# EasyEDA Pro project ProPrj_stm32线束检测系统_2025-05-19.epro, board stm32h743
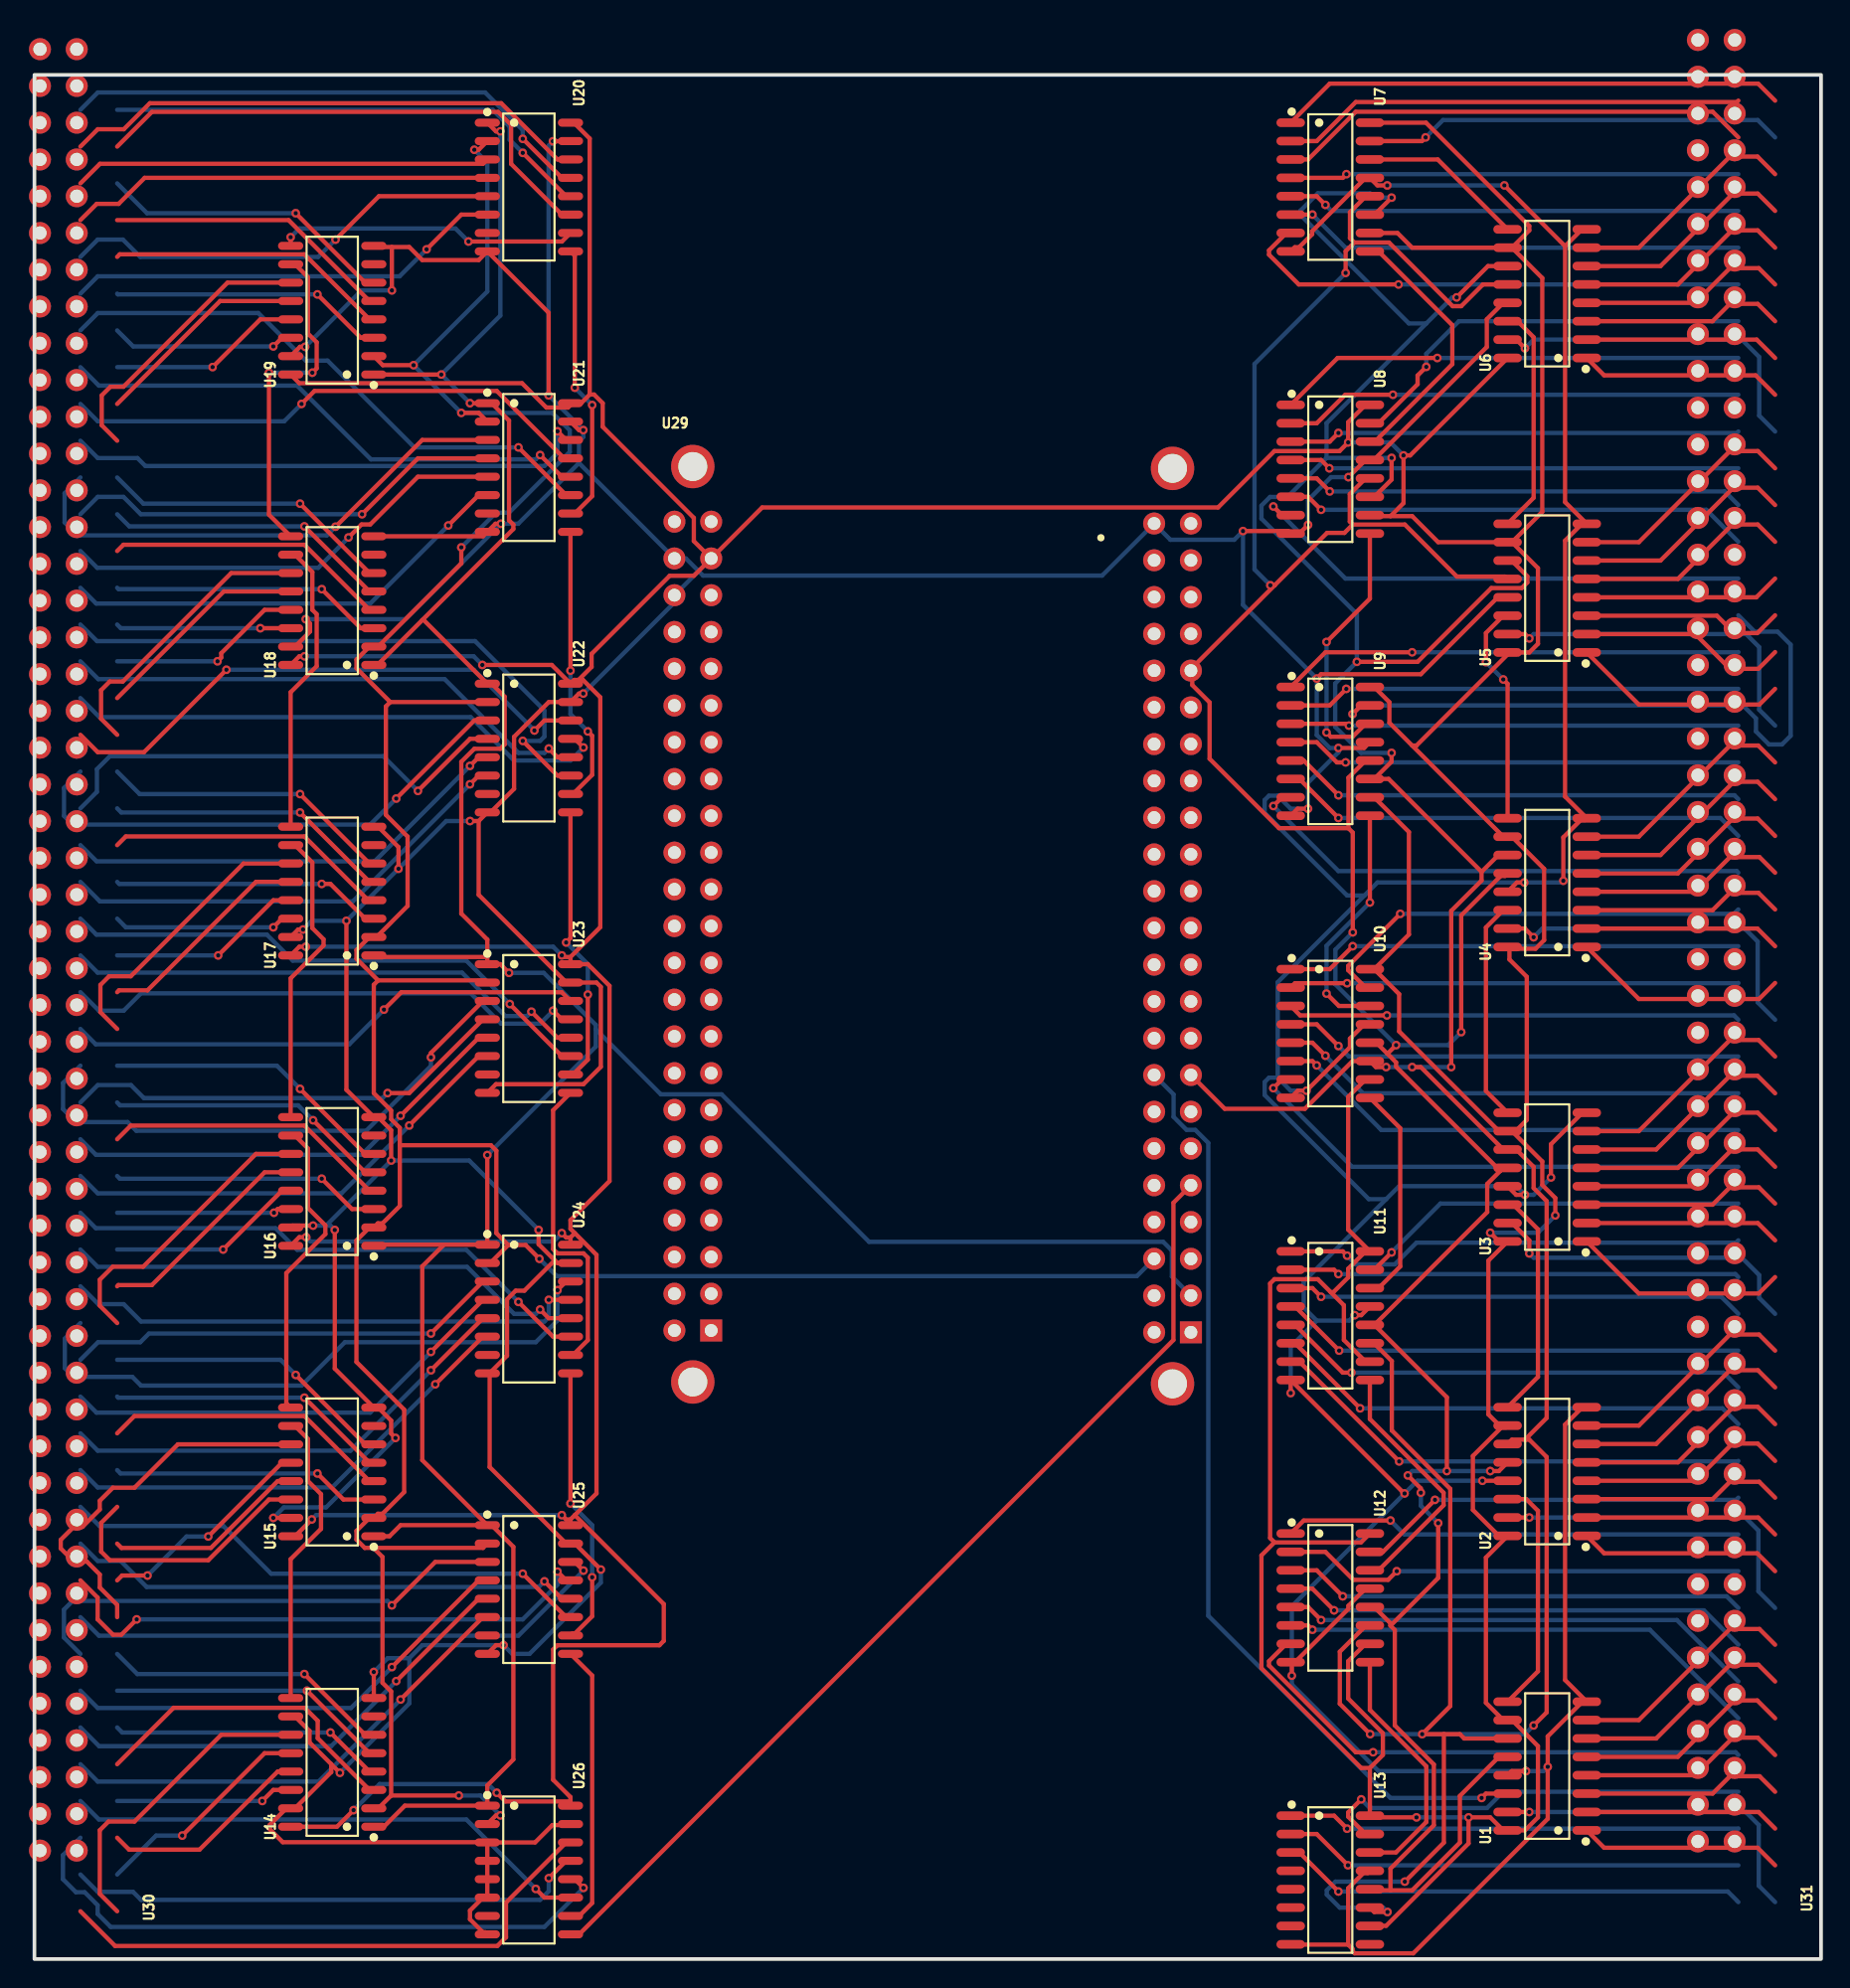
[diagram p1: board, top side]
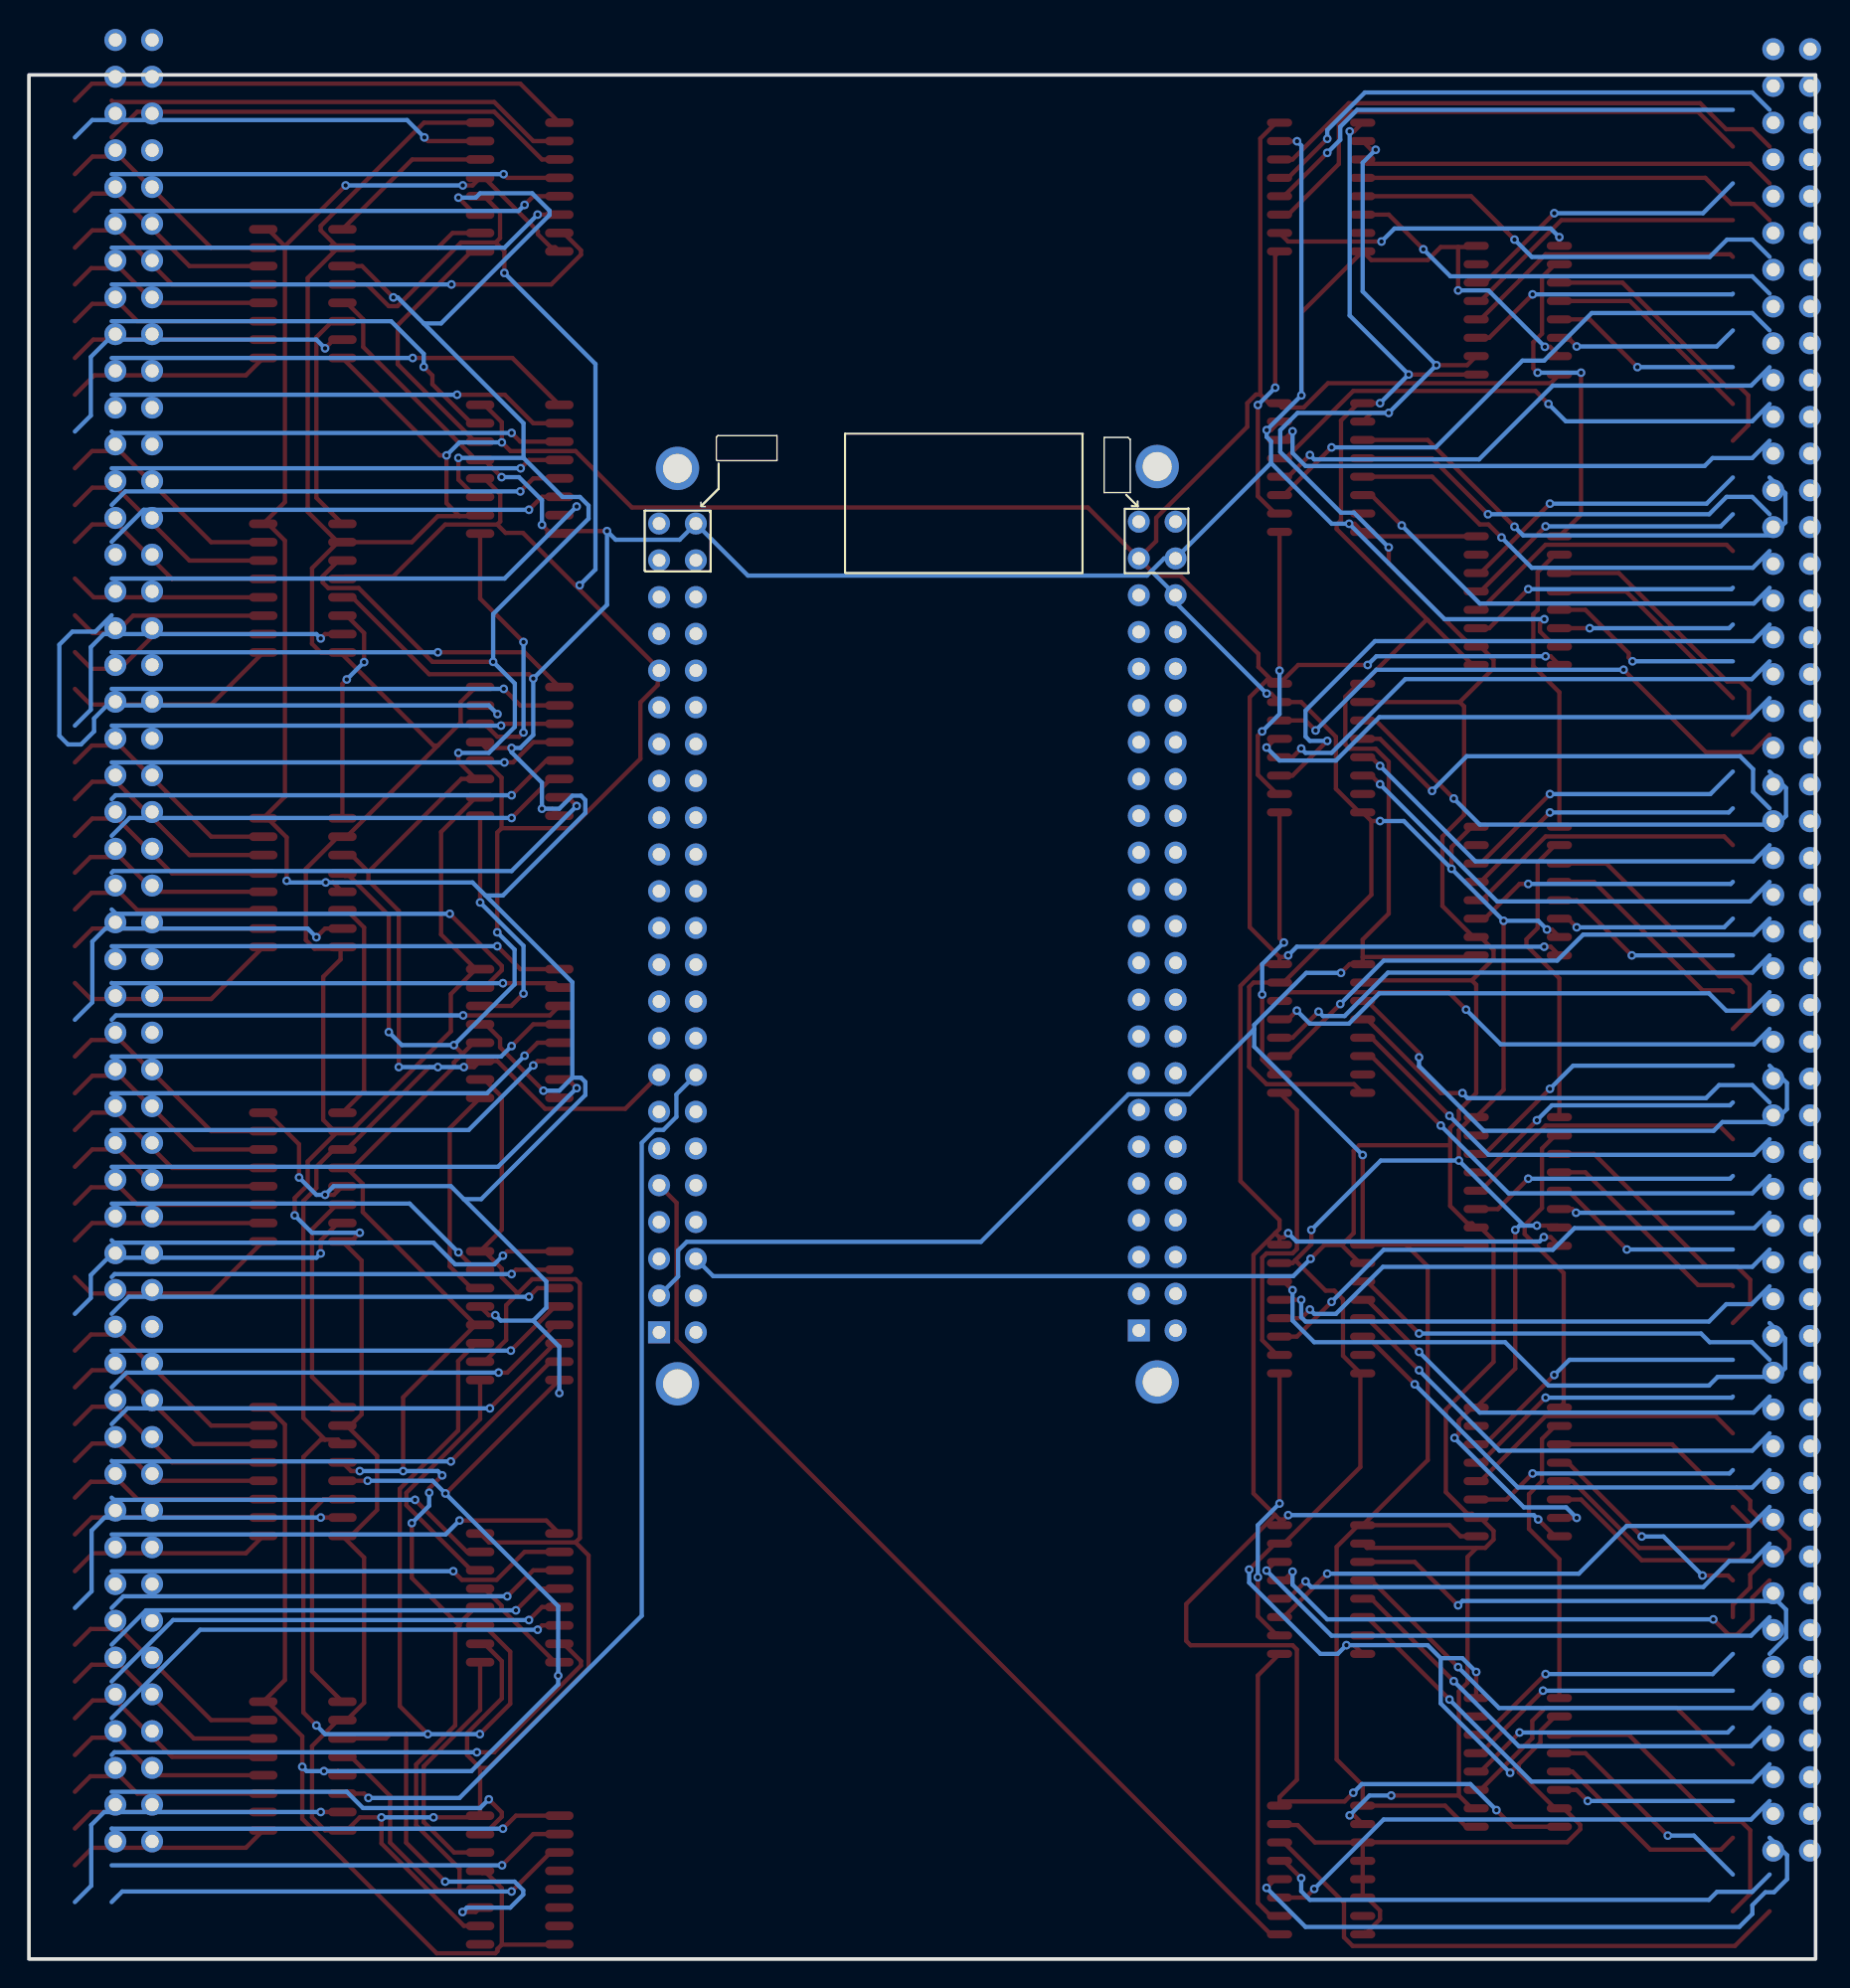
[diagram p2: board, bottom side, seen from below]

Outline 123.44 x 130.18 mm; copper layers: Top Layer, Signal Layer 1, Signal Layer 2, Bottom Layer. Coordinates in mm from the lower left corner of the outline.
Outline path: rectangle 0,130.18 123.44,0
Stack: Top Layer 0.0356mm / Signal Layer 1 0.036mm / Signal Layer 2 0.036mm / Bottom Layer 0.0356mm

## Design rules (mm)
net C4: 176v2
net C10: 176v2
net C14: 176v2
net C15: 176v2
net C24: 176v2
net C25: 176v2
net C26: 176v2
net C27: 176v2
net C28: 176v2
net C30: 176v2
net CON1: 176v2
net J3: 176v2
net R13: 176v2
net R14: 176v2
net R15: 176v2
net R51: 176v2
net R116: 176v2
net R117: 176v2
net R1013: 176v2
net U3: 176v2
net XY1: 176v2
net BAT: 176v2
net C3A: 176v2
net C3: 176v2
net C7: 176v2
net C8: 176v2
net C9: 176v2
net C29: 176v2
net dd3: 176v2
net R4: 176v2
net R7: 176v2
net R8: 176v2
net R9: 176v2
net R11: 176v2
net R12: 176v2
net SD1: 176v2
net U2: 176v2
net SW3: 176v2
net LED: 176v2
net QPSI: 176v2
net R8A: 176v2
net SPI: 176v2
net C27A: 176v2
net C28A: 176v2
net Y1: 176v2
net RP1: 176v2
net LED3: 176v2
net C29A: 176v2
net TYPE: 176v2
net U1: 176v2
net SWD: 176v2
net C21A: 176v2
net CAM: 176v2
net D1: 176v2
net FPC: 176v2
net ISP: 176v2
net Q1: 176v2
net Q2: 176v2
net R7A: 176v2
net R8AA: 176v2
net R19: 176v2
net JA: 176v2
net JB: 176v2
net J5: 176v2
template: 用户自定义配置
spacing Clearance_1 (default): track to track 0.15, other pairs 0.15 to 0.15
track width Width (default): min 0.3, default 0.3, max 1.001
differential pair DiffPairsRouting (default): width min 0.381, default 0.381, max 0.381; gap min 0.254, default 0.254
via RoutingVias (default): diameter min 0, default 0.599, max 1.27; hole min 0, default 0.3, max 0.711

## Placement (name value [footprint] x y rotation side)
U1  74HC595D,118  [SOIC-16_L9.9-W3.9-P1.27-LS6.0-BL]  104.52 13.34 90 top
U2  74HC595D,118  [SOIC-16_L9.9-W3.9-P1.27-LS6.0-BL]  104.52 33.68 90 top
U3  74HC595D,118  [SOIC-16_L9.9-W3.9-P1.27-LS6.0-BL]  104.52 54.03 90 top
U4  74HC595D,118  [SOIC-16_L9.9-W3.9-P1.27-LS6.0-BL]  104.52 74.37 90 top
U5  74HC595D,118  [SOIC-16_L9.9-W3.9-P1.27-LS6.0-BL]  104.52 94.72 90 top
U6  74HC595D,118  [SOIC-16_L9.9-W3.9-P1.27-LS6.0-BL]  104.52 115.06 90 top
U7  74HC595D,118  [SOIC-16_L9.9-W3.9-P1.27-LS6.0-BL]  89.53 122.43 270 top
U8  74HC595D,118  [SOIC-16_L9.9-W3.9-P1.27-LS6.0-BL]  89.53 102.93 270 top
U9  74HC595D,118  [SOIC-16_L9.9-W3.9-P1.27-LS6.0-BL]  89.53 83.44 270 top
U10  74HC595D,118  [SOIC-16_L9.9-W3.9-P1.27-LS6.0-BL]  89.53 63.94 270 top
U11  74HC595D,118  [SOIC-16_L9.9-W3.9-P1.27-LS6.0-BL]  89.53 44.45 270 top
U12  74HC595D,118  [SOIC-16_L9.9-W3.9-P1.27-LS6.0-BL]  89.53 24.96 270 top
U13  74HC595D,118  [SOIC-16_L9.9-W3.9-P1.27-LS6.0-BL]  89.53 5.46 270 top
U14  74HC165D-JSM  [SOP-16_L10.0-W3.9-P1.27-LS6.0-BL]  20.57 13.59 90 top
U15  74HC165D-JSM  [SOP-16_L10.0-W3.9-P1.27-LS6.0-BL]  20.57 33.66 90 top
U16  74HC165D-JSM  [SOP-16_L10.0-W3.9-P1.27-LS6.0-BL]  20.57 53.72 90 top
U17  74HC165D-JSM  [SOP-16_L10.0-W3.9-P1.27-LS6.0-BL]  20.57 73.79 90 top
U18  74HC165D-JSM  [SOP-16_L10.0-W3.9-P1.27-LS6.0-BL]  20.57 93.85 90 top
U19  74HC165D-JSM  [SOP-16_L10.0-W3.9-P1.27-LS6.0-BL]  20.57 113.92 90 top
U20  74HC165D-JSM  [SOP-16_L10.0-W3.9-P1.27-LS6.0-BL]  34.16 122.43 270 top
U21  74HC165D-JSM  [SOP-16_L10.0-W3.9-P1.27-LS6.0-BL]  34.16 103.05 270 top
U22  74HC165D-JSM  [SOP-16_L10.0-W3.9-P1.27-LS6.0-BL]  34.16 83.67 270 top
U23  74HC165D-JSM  [SOP-16_L10.0-W3.9-P1.27-LS6.0-BL]  34.16 64.29 270 top
U24  74HC165D-JSM  [SOP-16_L10.0-W3.9-P1.27-LS6.0-BL]  34.16 44.91 270 top
U25  74HC165D-JSM  [SOP-16_L10.0-W3.9-P1.27-LS6.0-BL]  34.16 25.53 270 top
U26  74HC165D-JSM  [SOP-16_L10.0-W3.9-P1.27-LS6.0-BL]  34.16 6.15 270 top
U29  -  [stm32h743]  62.86 69.85 0 top
U30  -  [2x50_P2.54_TH]  5.71 3.3 90 top
U31  -  [2x50_P2.54_TH]  120.27 3.94 90 top

## Footprints (pads in the part's own frame, mm; a bottom-side part is the same pattern mirrored in y, then rotated)
2x50_P2.54_TH
  round 1.524 hole 0.914: 1(4.191,2.794) 2(6.731,2.794) 3(9.271,2.794) 4(11.811,2.794) 5(14.351,2.794) 6(16.891,2.794) 7(19.431,2.794) 8(21.971,2.794) 9(24.511,2.794) 10(27.051,2.794) 11(29.591,2.794) 12(32.131,2.794) 13(34.671,2.794) 14(37.211,2.794) 15(39.751,2.794) 16(42.291,2.794) 17(44.831,2.794) 18(47.371,2.794) 19(49.911,2.794) 20(52.451,2.794) 21(54.991,2.794) 22(57.531,2.794) 23(60.071,2.794) 24(62.611,2.794) 25(65.151,2.794) 26(67.691,2.794) 27(70.231,2.794) 28(72.771,2.794) 29(75.311,2.794) 30(77.851,2.794) 31(80.391,2.794) 32(82.931,2.794) 33(85.471,2.794) 34(88.011,2.794) 35(90.551,2.794) 36(93.091,2.794) 37(95.631,2.794) 38(98.171,2.794) 39(100.711,2.794) 40(103.251,2.794) 41(105.791,2.794) 42(108.331,2.794) 43(110.871,2.794) 44(113.411,2.794) 45(115.951,2.794) 46(118.491,2.794) 47(121.031,2.794) 48(123.571,2.794) 49(126.111,2.794) 50(128.651,2.794) 51(128.651,5.334) 52(126.111,5.334) 53(123.571,5.334) 54(121.031,5.334) 55(118.491,5.334) 56(115.951,5.334) 57(113.411,5.334) 58(110.871,5.334) 59(108.331,5.334) 60(105.791,5.334) 61(103.251,5.334) 62(100.711,5.334) 63(98.171,5.334) 64(95.631,5.334) 65(93.091,5.334) 66(90.551,5.334) 67(88.011,5.334) 68(85.471,5.334) 69(82.931,5.334) 70(80.391,5.334) 71(77.851,5.334) 72(75.311,5.334) 73(72.771,5.334) 74(70.231,5.334) 75(67.691,5.334) 76(65.151,5.334) 77(62.611,5.334) 78(60.071,5.334) 79(57.531,5.334) 80(54.991,5.334) 81(52.451,5.334) 82(49.911,5.334) 83(47.371,5.334) 84(44.831,5.334) 85(42.291,5.334) 86(39.751,5.334) 87(37.211,5.334) 88(34.671,5.334) 89(32.131,5.334) 90(29.591,5.334) 91(27.051,5.334) 92(24.511,5.334) 93(21.971,5.334) 94(19.431,5.334) 95(16.891,5.334) 96(14.351,5.334) 97(11.811,5.334) 98(9.271,5.334) 99(6.731,5.334) 100(4.191,5.334)
SOIC-16_L9.9-W3.9-P1.27-LS6.0-BL
  oval 0.602x1.971 smd: 1(-4.445,-2.736) 2(-3.175,-2.736) 3(-1.905,-2.736) 4(-0.635,-2.736) 5(0.635,-2.736) 6(1.905,-2.736) 7(3.175,-2.736) 8(4.445,-2.736) 9(4.445,2.736) 10(3.175,2.736) 11(1.905,2.736) 12(0.635,2.736) 13(-0.635,2.736) 14(-1.905,2.736) 15(-3.175,2.736) 16(-4.445,2.736)
SOP-16_L10.0-W3.9-P1.27-LS6.0-BL
  oval 0.56x1.745 smd: 1(-4.445,-2.873) 2(-3.175,-2.873) 3(-1.905,-2.873) 4(-0.635,-2.873) 5(0.635,-2.873) 6(1.905,-2.873) 7(3.175,-2.873) 8(4.445,-2.873) 9(4.445,2.873) 10(3.175,2.873) 11(1.905,2.873) 12(0.635,2.873) 13(-0.635,2.873) 14(-1.905,2.873) 15(-3.175,2.873) 16(-4.445,2.873)
stm32h743
  round 3 hole 2: (-17.378,33.267) (-17.378,-29.979) (15.769,33.139) (15.77,-30.106)
  rect 1.524x1.524 hole 0.889: 1(17.04,-26.55) 47(-16.108,-26.423)
  round 1.524 hole 0.889: 2(14.499,-26.55) 3(17.04,-24.01) 4(14.499,-24.01) 5(17.04,-21.47) 6(14.499,-21.47) 7(17.04,-18.93) 8(14.499,-18.93) 9(17.04,-16.39) 10(14.499,-16.39) 11(17.04,-13.85) 12(14.499,-13.85) 13(17.04,-11.31) 14(14.499,-11.31) 15(17.04,-8.77) 16(14.499,-8.77) 17(17.04,-6.23) 18(14.499,-6.23) 19(17.04,-3.69) 20(14.499,-3.69) 21(17.04,-1.15) 22(14.499,-1.15) 23(17.04,1.39) 24(14.499,1.39) 25(17.04,3.93) 26(14.499,3.93) 27(17.04,6.47) 28(14.499,6.47) 29(17.04,9.01) 30(14.499,9.01) 31(17.04,11.55) 32(14.499,11.55) 33(17.04,14.09) 34(14.499,14.09) 35(17.04,16.63) 36(14.499,16.63) 37(17.04,19.169) 38(14.499,19.17) 39(17.04,21.709) 40(14.499,21.71) 41(17.04,24.25) 42(14.499,24.25) 43(17.04,26.79) 44(14.499,26.79) 45(17.04,29.329) 46(14.499,29.33) 48(-18.648,-26.423) 49(-16.108,-23.883) 50(-18.648,-23.883) 51(-16.108,-21.343) 52(-18.648,-21.343) 53(-16.108,-18.803) 54(-18.648,-18.803) 55(-16.108,-16.263) 56(-18.648,-16.263) 57(-16.108,-13.723) 58(-18.648,-13.723) 59(-16.108,-11.183) 60(-18.648,-11.183) 61(-16.108,-8.643) 62(-18.648,-8.643) 63(-16.108,-6.103) 64(-18.648,-6.103) 65(-16.108,-3.563) 66(-18.648,-3.563) 67(-16.108,-1.023) 68(-18.648,-1.023) 69(-16.108,1.517) 70(-18.648,1.517) 71(-16.108,4.057) 72(-18.648,4.057) 73(-16.108,6.597) 74(-18.648,6.597) 75(-16.108,9.137) 76(-18.648,9.137) 77(-16.108,11.677) 78(-18.648,11.677) 79(-16.108,14.217) 80(-18.648,14.217) 81(-16.108,16.756) 82(-18.648,16.757) 83(-16.108,19.297) 84(-18.648,19.297) 85(-16.108,21.837) 86(-18.648,21.837) 87(-16.108,24.377) 88(-18.648,24.377) 89(-16.108,26.916) 90(-18.648,26.917) 91(-16.108,29.456) 92(-18.648,29.457)

## Nets
As in the schematic, except:
GND: U1.8 U1.13 U2.8 U2.13 U3.8 U3.13 U4.8 U4.13 U5.8 U5.13 U6.8 U6.13 U7.8 U7.13 U8.8 U8.13 U9.8 U9.13 U10.8 U10.13 U11.8 U11.13 U12.8 U12.13 U13.8 U13.13 U14.8 U14.10 U14.15 U15.8 U15.15 U16.8 U16.15 U17.8 U17.15 U18.8 U18.15 U19.8 U19.15 U20.8 U20.15 U21.8 U21.15 U22.8 U22.15 U23.8 U23.15 U24.8 U24.15 U25.8 U25.15 U26.3 U26.4 U26.5 U26.6 U26.8 U26.15 U29.46 U29.88 U29.90
VCC: U1.10 U1.16 U2.10 U2.16 U3.10 U3.16 U4.10 U4.16 U5.10 U5.16 U6.10 U6.16 U7.10 U7.16 U8.10 U8.16 U9.10 U9.16 U10.10 U10.16 U11.10 U11.16 U12.10 U12.16 U13.10 U13.16 U14.16 U15.16 U16.16 U17.16 U18.16 U19.16 U20.16 U21.16 U22.16 U23.16 U24.16 U25.16 U26.16 U29.89
HC165_CLK: U14.2 U15.2 U16.2 U17.2 U18.2 U19.2 U20.2 U21.2 U22.2 U23.2 U24.2 U25.2 U26.2 U29.6
HC165_SH_LD: U14.1 U15.1 U16.1 U17.1 U18.1 U19.1 U20.1 U21.1 U22.1 U23.1 U24.1 U25.1 U26.1 U29.3
HC595_DS: U1.14 U29.16
HC595_SHCP: U1.11 U2.11 U3.11 U4.11 U5.11 U6.11 U7.11 U8.11 U9.11 U10.11 U11.11 U12.11 U13.11 U29.15
HC595_STCP: U1.12 U2.12 U3.12 U4.12 U5.12 U6.12 U7.12 U8.12 U9.12 U10.12 U11.12 U12.12 U13.12 U29.37
SER165_CHAIN13: U26.9 U29.9

Pads without a net: U13 4 5 6 7 9; U14 7; U15 7; U16 7; U17 7; U18 7; U19 7; U20 7; U21 7; U22 7; U23 7; U24 7; U25 7; U26 7; U29 1 2 4 5 7 8 10 11 12 13 14 17 18 19 20 21 22 23 24 25 26 27 28 29 30 31 32 33 34 35 36 38 39 40 41 42 43 44 45 47 48 49 50 51 52 53 54 55 56 57 58 59 60 61 62 63 64 65 66 67 68 69 70 71 72 73 74 75 76 77 78 79 80 81 82 83 84 85 86 87 91 92

## Via types
v1: diameter 0.6, hole 0.299, Top Layer to Bottom Layer, 245 vias

## Routing (per net, layer and track width the routed paths; a pad name or vN(x,y) marks a point on that pad's centre or on a via; arc(x,y) is an arc through that point)
GND: length 767.8
  Top Layer w0.299: U7.8 87.08,118.27 87.38,118.27 88.28,119.17 88.28,119.38 91.97,123.06 U7.13 92.79,122.54 v1(93.47,122.54) ; U19.8 23.53,118.28 24.7,118.28 ; v1(83.5,98.66) 86.63,98.66 U8.8 87.4,98.49 v1(88,99.09) ; v1(88,79.48) 87.28,79.48 U9.8 ; U11.13 91.67,44.49 v1(91.22,44.49) ; v1(88.6,88.47) 88.9,88.77 95.79,88.77 101.1,94.08 U5.13 ; U26.15 36.96,9.26 35.79,9.26 34.59,8.06 U26.3 ; U13.13 92.13,5.95 91.83,5.95 90.77,4.89 90.77,1 ; 31.45,40.48 31.45,33.99 36.74,28.71 U25.15 37.33,28.71 v1(39.13,26.91) ; 31.45,40.48 32.65,41.68 32.65,45.58 33.25,46.18 33.85,46.18 35.95,48.28 ; 31.45,40.48 31.31,40.48 U24.8 ; 90.77,1 91.07,0.7 91.07,0.55 91.22,0.4 95.27,0.4 104.56,9.69 v1(104.56,13.28) 104.56,15.38 106.96,17.78 U1.8 105.76,19.28 105.76,36.93 106.96,38.13 U2.8 ; 90.77,1 86.82,1 U13.8 ; U18.8 30.98,98.3 U21.8 31.85,99.16 v1(32.23,99.16) ; v1(105.64,74.5) 105.64,77.5 106.83,78.69 107.13,78.69 U4.8 105.76,80.32 105.76,98 106.92,99.16 U5.8 105.76,100.66 105.76,118.34 ; v1(94.67,32.17) 94.64,32.17 U11.8 v1(86.8,39.11) ; 30.69,78.62 v1(30.09,78.62) ; 30.69,78.62 U22.8 31.51,79.22 33.14,80.85 33.14,84.45 35.54,86.84 U22.15 37.62,87.43 v1(37.92,87.43) ; 30.69,78.62 30.69,73.53 36.69,67.54 36.96,67.54 U23.15 38.83,67.47 39.13,67.17 39.13,61.64 37.93,60.44 31.89,60.44 U23.8 ; U14.10 18,16.76 19.01,15.76 19.01,14.97 20.5,13.47 ; 35.95,48.28 36.14,48.09 U24.15 ; 35.95,48.28 34.84,49.39 v1(34.84,50.37) ; 105.76,118.34 v1(101.56,122.54) ; 105.76,118.34 106.92,119.51 U6.8 ; U10.8 87.29,60 v1(87.89,60) 90.89,62.99 90.89,63.59 91.88,64.58 U10.13 ; v1(90.79,102.39) 91.99,103.58 92.26,103.58 ; v1(102.94,74.38) 102.43,74.38 U4.13 ; v1(24.94,36) 24.65,36.3 24.65,37.2 23.75,38.1 U15.8 20.75,40.8 v1(20.75,50.37) ; 24.7,118.28 25.9,118.28 26.79,117.38 30.69,117.38 U20.8 35.53,113.75 v1(35.53,108.03) ; 24.7,118.28 v1(24.7,115.29) ; U1.13 102.07,12.98 v1(103.06,12.98) ; U17.15 18.22,71.13 v1(18.56,71.13) ; v1(102.98,52.8) 102.37,52.8 U3.13 ; U25.8 31.89,21.69 v1(32.41,21.69) ; U9.13 91.87,83.67 v1(90.1,83.67) ; 20.5,13.47 v1(21.1,12.87) ; 20.5,13.47 20.5,12.92 18.06,10.47 17.76,10.47 ; 92.26,103.58 U8.13 ; 92.26,103.58 92.55,103.58 100.35,111.38 100.35,113.29 101.49,114.43 U6.13 ; U26.3 U26.4 U26.5 U26.6 30.99,4.25 30.09,3.35 30.09,2.75 30.99,1.85 31.15,1.85 U26.8 ; U26.3 31.28,8.07 17.16,8.07 16.26,8.97 16.26,9.27 17.46,10.47 17.76,10.47 ; U20.15 37.02,125.59 v1(35.82,125.59) ; v1(37.92,105.64) 37.62,105.64 U21.15 ; v1(16.5,30.48) 17.7,30.48 ; U3.8 107.18,58.39 106.88,58.39 104.78,56.3 v1(104.78,54) ; v1(18.7,111.39) 18.35,111.39 U19.15 ; v1(19.25,50.67) 17.83,50.67 U16.15 ; v1(23.45,19.83) U14.8 ; U12.13 91.97,25.59 90.79,24.41 90.79,24.2 87.1,20.51 U12.8 86.88,20.43 v1(86.88,19.58) ; 17.76,10.47 U14.15 ; v1(100.04,33.05) U2.13 ; v1(24.65,55.17) 24.65,57.27 23.75,58.17 U16.8 21.55,60.06 v1(21.55,71.73) ; v1(18.74,92.57) 19.04,92.27 19.04,91.72 18,90.68 U18.15 ; U17.8 23.75,78.23 25.15,76.83 v1(25.15,75.33)
  Bottom Layer w0.299: v1(86.8,39.11) 86.8,42.31 88.6,44.11 ; v1(34.84,50.37) 30.04,55.17 v1(24.65,55.17) 20.15,50.67 ; v1(35.82,125.59) 35.53,125.29 v1(35.53,108.03) v1(37.92,105.64) 37.92,105.16 37.62,104.86 37.62,103.36 ; v1(20.75,50.37) 20.45,50.67 20.15,50.67 ; 85.9,60.89 86.8,60 v1(87.89,60) ; 85.9,60.89 85.3,60.89 85,60.59 85,59.7 92.19,52.5 93.39,52.5 ; 85.9,60.89 85.9,67.49 91.89,73.48 ; 93.39,52.5 94.29,53.4 102.39,53.4 v1(102.98,52.8) 103.58,52.8 v1(104.78,54) ; 93.39,52.5 87.7,46.81 87.7,45.01 88.6,44.11 ; 25.9,20.79 26.8,21.69 v1(32.41,21.69) 33.01,21.09 34.21,21.09 39.13,26.01 v1(39.13,26.91) ; 25.9,20.79 25.9,17.66 v1(21.1,12.87) ; 25.9,20.79 24.4,20.79 v1(23.45,19.83) ; 91.89,73.48 92.79,74.38 v1(102.94,74.38) 105.52,74.38 v1(105.64,74.5) ; 91.89,73.48 90.7,73.48 85,79.18 85,80.08 85.3,80.38 85.9,80.38 86.8,79.48 v1(88,79.48) 88,81.28 90.1,83.37 v1(90.1,83.67) 89.5,83.67 88.6,84.57 v1(88.6,88.47) 83.5,93.56 v1(83.5,98.66) 82.9,98.06 78.48,98.06 U29.46 73.77,95.58 46.19,95.58 45.89,95.88 ; v1(88,99.09) 88,100.8 89.59,102.39 v1(90.79,102.39) ; v1(24.94,36) 20.15,31.21 17.23,31.21 v1(16.5,30.48) ; v1(30.09,78.62) 28.45,78.62 v1(25.15,75.33) v1(21.55,71.73) 19.16,71.73 v1(18.56,71.13) ; 20.15,50.67 v1(19.25,50.67) ; 45.89,95.88 45.87,95.88 U29.88 44.22,93.73 v1(37.92,87.43) ; 45.89,95.88 45.01,96.77 U29.90 37.62,103.36 ; 88.6,44.11 90.84,44.11 v1(91.22,44.49) ; 37.62,103.36 33.43,99.16 v1(32.23,99.16) 25.63,92.57 v1(18.74,92.57) ; v1(24.7,115.29) 22.6,115.29 v1(18.7,111.39) ; v1(100.04,33.05) 95.55,33.05 v1(94.67,32.17) 86.88,24.37 v1(86.88,19.58) 86.88,18.98 92.87,12.98 v1(103.06,12.98) 104.26,12.98 v1(104.56,13.28) ; v1(101.56,122.54) v1(93.47,122.54)
VCC: length 654.2
  Top Layer w0.299: 102.08,118.24 103.28,119.44 103.28,119.74 96.15,126.87 U7.16 ; 102.08,118.24 U6.10 95.19,118.24 94.18,119.25 U7.10 ; 102.08,118.24 104.18,116.14 104.18,99.99 102.08,97.89 ; 95.19,83.84 93.62,85.42 93.62,86.84 92.57,87.88 U9.16 ; 95.19,83.84 101.49,77.55 U4.10 101.91,77.42 102.21,77.42 104.31,75.32 104.31,70.4 103.71,69.8 101.91,69.8 ; 95.19,83.84 95.49,83.84 101.79,90.13 U5.16 103.28,90.27 103.88,90.87 103.88,96.09 102.08,97.89 ; 38.37,108.09 38.66,108.09 39.26,107.49 39.26,105.86 45.56,99.57 45.56,97.97 U29.89 ; 38.37,108.09 37.77,107.49 37.17,107.49 ; 38.37,108.09 38.37,125.78 37.27,126.87 U20.16 ; v1(18.78,49.88) 18.3,49.88 U16.16 ; U2.10 101.66,36.73 101.36,36.73 ; 37.33,50.15 38.83,48.65 38.83,32.17 37.33,30.67 ; 37.33,50.15 37.04,50.45 37.04,51.05 39.73,53.75 39.73,67.24 38.23,68.73 U23.16 37.04,69.23 ; 37.33,50.15 37.04,49.85 ; 37.17,107.49 U21.16 ; 37.17,107.49 36.87,107.19 35.37,107.19 33.69,108.87 18.3,108.87 U19.16 ; U9.10 92.57,80.26 94.97,77.87 94.97,70.79 92.57,68.39 ; 101.91,69.8 101.79,69.93 ; 101.91,69.8 101.91,69.06 103.11,67.86 103.11,57.97 102.21,57.07 ; v1(95.49,9.79) 92.39,9.79 U13.16 92.27,13.2 ; v1(19.16,30.37) 18,29.21 U15.16 ; v1(105.08,51.38) 105.08,52.58 104.18,53.48 104.18,55.1 102.21,57.07 ; 89.57,46.07 90.47,45.17 90.47,42.77 91.97,41.28 U11.10 ; 89.57,46.07 89.75,46.07 90.77,47.1 90.77,47.7 91.97,48.9 U11.16 90.77,50.39 90.77,59.57 91.97,60.77 U10.10 ; 89.57,46.07 88.67,46.97 85.68,46.97 85.38,46.67 85.38,29.09 85.68,28.79 ; v1(100.59,50.18) 101.19,49.58 U3.16 100.46,48.26 100.46,37.63 101.36,36.73 ; v1(18.66,90.01) 18.3,90.01 U18.16 ; 37.04,69.23 36.55,69.23 v1(36.44,69.34) ; 37.04,69.23 39.09,71.29 39.09,87.18 37.89,88.37 37.6,88.37 ; 37.6,88.37 37.3,88.37 U22.16 35.74,89.41 v1(30.95,89.41) ; 37.6,88.37 38.49,89.27 38.49,90.17 43.89,95.57 45.56,95.57 U29.89 ; U29.89 50.28,100.29 81.78,100.29 85.68,104.19 90.17,104.19 v1(90.77,104.78) 90.77,106.18 91.97,107.38 U8.16 ; 102.08,97.89 U5.10 96.99,97.89 95.19,99.69 93.69,99.69 ; 37.33,30.67 43.48,24.52 43.48,21.98 43.18,21.68 36.14,21.68 35.84,21.38 35.84,12.39 37.04,11.19 37.04,10.89 ; 37.33,30.67 37.04,30.37 ; v1(36.44,50.15) 36.74,49.85 37.04,49.85 ; v1(36.44,30.67) 36.74,30.37 37.04,30.37 ; 102.21,57.07 101.91,57.07 U3.10 101.19,57.2 94.29,64.09 94.29,66.67 92.57,68.39 ; 85.68,28.79 91.66,28.79 U12.16 ; 85.68,28.79 84.78,27.89 84.78,20.1 91.67,13.2 92.27,13.2 ; U14.16 20.9,9.14 v1(22.05,10.29) ; 37.04,30.37 U25.16 ; 37.04,10.89 U26.16 ; 37.04,10.89 32.54,10.89 v1(31.94,11.49) ; 93.69,99.69 92.34,99.69 U8.10 ; 93.69,99.69 94.59,100.59 v1(94.59,103.89) 95.05,103.89 U6.16 ; 92.27,13.2 93.17,14.1 93.17,15.6 90.77,18 90.77,20.58 91.97,21.78 U12.10 ; U13.10 92.28,2.3 93.39,2.3 99.09,7.99 v1(99.09,9.79) 100.59,9.79 101.49,8.89 U1.16 102.98,8.89 103.88,9.79 103.88,14.71 102.08,16.51 U1.10 101.49,16.51 100.29,17.71 100.29,27.74 U2.16 101.19,29.24 99.39,31.03 99.39,34.76 101.36,36.73 ; 37.04,49.85 U24.16 ; 92.57,68.39 U10.16 ; v1(18.75,69.94) 18.3,69.94 U17.16
  Bottom Layer w0.299: v1(18.78,49.88) 19.07,49.58 35.86,49.58 v1(36.44,50.15) ; v1(18.75,69.94) 35.84,69.94 v1(36.44,69.34) ; v1(31.94,11.49) 31.34,12.09 23.85,12.09 v1(22.05,10.29) ; v1(100.59,50.18) 103.88,50.18 v1(105.08,51.38) ; v1(90.77,104.78) 93.69,104.78 v1(94.59,103.89) ; v1(36.44,30.67) 19.46,30.67 v1(19.16,30.37) ; v1(30.95,89.41) 30.35,90.01 v1(18.66,90.01) ; v1(99.09,9.79) v1(95.49,9.79)
HC165_CLK: length 243.3
  Top Layer w0.299: 23.75,67.62 22.25,69.11 22.25,69.71 23.15,70.61 U17.2 23.64,70.61 25.78,72.76 25.78,77.55 24.28,79.05 24.28,86.54 24.58,86.84 ; 23.75,67.62 31.14,67.62 U23.2 ; 23.75,67.62 23.45,67.32 23.45,59.82 24.65,58.62 24.65,58.02 25.24,57.42 25.24,56.23 ; 24.65,11.3 v1(29.32,11.3) ; 24.65,11.3 24.65,18.49 24.05,19.09 24.05,27.78 23.42,28.41 ; 24.65,11.3 23.76,10.41 U14.2 ; 23.42,28.41 22.82,28.41 22.25,28.98 22.25,29.58 23.15,30.48 23.45,30.48 23.73,30.76 24.05,30.76 25.54,32.26 25.54,37.96 22.25,41.25 22.25,49.65 23.15,50.55 U16.2 23.73,50.83 24.05,50.83 25.24,52.03 25.24,56.23 ; 23.42,28.41 30.99,28.41 U25.2 ; 32.74,49.33 31.49,48.09 U24.2 ; 32.74,49.33 33.94,49.33 v1(34.89,48.38) ; 32.74,49.33 31.91,50.16 31.91,55.85 31.54,56.23 25.24,56.23 ; U20.2 30.69,125 v1(30.39,125) ; v1(29.49,106.82) 30.69,106.82 U21.2 ; v1(32.19,9.93) 31.89,9.93 U26.2 ; 24.58,86.84 22.25,89.18 22.25,89.78 23.15,90.68 U18.2 23.75,90.68 29.49,96.42 v1(29.49,97.53) ; 24.58,86.84 U22.2 ; v1(26.2,110.12) 24.07,110.12 U19.2
  Bottom Layer w0.299: v1(30.39,125) 31.29,124.1 31.29,115.22 v1(26.2,110.12) v1(29.49,106.82) 35.79,106.82 36.98,105.62 36.98,104.13 32.79,99.93 31.89,99.93 v1(29.49,97.53) ; v1(29.32,11.3) 30.82,11.3 v1(32.19,9.93) ; v1(34.89,48.38) 36.09,47.18 76.17,47.18 U29.6
HC165_SH_LD: length 233.4
  Top Layer w0.299: 28.29,49.36 U24.1 v1(31.29,55.55) ; 28.29,49.36 23.53,49.36 U16.1 ; 28.29,49.36 26.79,47.86 26.79,34.47 U25.1 ; U25.1 25.3,29.98 24.53,29.21 U15.1 ; U25.1 31.59,29.98 33.09,28.48 33.09,13.79 31.29,11.99 U26.1 25.6,10.6 24.14,9.14 U14.1 ; U18.1 23.69,89.41 26.79,92.51 ; v1(32.79,68.14) 32.19,68.73 U23.1 31.29,69.23 ; 26.79,92.51 33.09,98.8 33.09,99.1 32.79,99.4 32.79,106.3 31.59,107.49 U21.1 v1(30.09,107.49) ; 26.79,92.51 26.9,92.51 U22.1 31.59,88.11 32.49,87.22 32.49,83.92 32.19,83.62 30.39,83.62 29.49,82.72 29.49,72.23 31.29,70.43 31.29,69.23 ; U20.1 31.89,126.27 v1(32.19,126.27) ; v1(28.11,109.47) U19.1 ; U17.1 23.56,69.23 31.29,69.23
  Bottom Layer w0.299: v1(32.79,68.14) 35.19,68.14 38.78,64.54 38.78,64.24 ; 38.78,64.24 38.78,63.04 v1(31.29,55.55) ; 38.78,64.24 43.28,59.74 47.48,59.74 57.67,49.55 77.99,49.55 78.59,48.95 78.59,47.16 U29.3 ; v1(32.19,126.27) 32.19,113.55 v1(28.11,109.47) v1(30.09,107.49)
HC595_DS: length 65.3
  Top Layer w0.299: U1.14 100.29,11.43 v1(99.99,11.13)
  Bottom Layer w0.299: U29.16 78.71,59.74 78.71,58.19 79.61,57.29 80.21,57.29 81.1,56.39 81.1,23.72 93.69,11.13 v1(99.99,11.13)
HC595_SHCP: length 277.5
  Top Layer w0.299: U1.11 98.79,15.24 98.49,15.54 97.38,15.54 ; v1(93.77,103.71) 93.77,102.21 92.58,101.03 U8.11 ; 99.99,75.11 101.15,76.28 U4.11 ; 99.99,75.11 99.99,74.51 97.89,72.42 v1(97.89,61.63) ; 99.99,75.11 93.57,81.53 92.57,81.53 ; v1(93.39,61.63) 92.68,61.63 U10.11 91.07,62.04 87.77,58.74 82.24,58.74 U29.15 ; 97.38,15.54 97.38,8.05 v1(94.69,5.35) ; 97.38,15.54 v1(95.89,15.54) 97.82,17.48 97.82,32.48 93.79,36.52 93.79,41.32 92.56,42.55 U11.11 ; v1(93.77,83.33) 93.77,82.73 92.57,81.53 ; v1(92.29,15.54) 90.19,17.64 90.19,21.23 92.01,23.05 U12.11 ; v1(93.77,121.7) 92.6,120.52 U7.11 ; 102.98,35.89 103.28,35.89 104.48,34.69 104.48,17.04 v1(103.58,16.14) ; 102.98,35.89 102.08,35.89 U2.11 ; 102.98,35.89 104.48,37.38 104.48,52.37 103.58,53.27 103.58,54.73 102.39,55.93 U3.11 101.49,55.93 95.79,61.63 v1(95.19,61.63) ; 92.57,81.53 U9.11 ; U13.11 92.58,3.25 v1(93.49,3.25) ; U6.11 100.43,116.97 v1(98.27,114.8) ; v1(91.37,89.63) 95.57,89.63 100.66,94.72 102.76,94.72 103.15,95.11 103.15,95.53 102.06,96.62 U5.11
  Bottom Layer w0.299: 96.17,113 94.97,113 87.47,120.5 87.47,120.8 88.67,122 92.27,122 92.57,121.7 v1(93.77,121.7) ; 96.17,113 89.27,106.11 89.27,103.71 ; 96.17,113 97.97,114.8 v1(98.27,114.8) ; 89.27,103.71 86.58,101.02 85.38,101.02 84.78,100.42 84.78,99.52 91.37,92.92 v1(91.37,89.63) 89.87,88.13 89.87,85.13 91.67,83.33 v1(93.77,83.33) ; 89.27,103.71 v1(93.77,103.71) ; v1(92.29,15.54) v1(95.89,15.54) 102.98,15.54 v1(103.58,16.14) ; v1(94.69,5.35) 89.89,5.35 89.29,4.75 89.29,4.45 90.19,3.55 93.19,3.55 v1(93.49,3.25) ; v1(93.39,61.63) v1(95.19,61.63) v1(97.89,61.63)
HC595_STCP: length 233.5
  Top Layer w0.299: v1(91.09,70.94) 91.09,77.83 90.79,78.13 ; U1.12 101.19,13.97 98.49,11.27 98.49,8.05 95.19,4.75 93.69,4.75 ; 91.09,99.11 90.51,98.53 89.31,98.53 85.69,94.91 ; 91.09,99.11 90.88,99.32 90.88,101.21 91.97,102.3 U8.12 ; 91.09,99.11 94.68,99.11 98.28,95.51 101.62,95.51 U5.12 ; v1(97.59,33.72) 97.59,38.81 92.59,43.82 ; 93.69,4.75 93.69,6.25 96.69,9.25 96.69,13.44 93.99,16.14 93.99,22.73 93.69,23.03 ; 93.69,4.75 92.35,4.75 92.27,4.83 ; U3.12 101.49,54.66 101.28,54.45 ; 101.28,54.45 94.08,61.65 94.08,61.95 93.48,62.55 ; 101.28,54.45 100.38,53.55 100.38,51.61 92.59,43.82 ; 90.79,78.13 85.99,78.13 81.2,82.93 81.2,86.82 80,88.02 80,88.92 ; 90.79,78.13 90.79,81.62 91.99,82.82 92.26,82.82 U9.12 ; 93.48,62.55 v1(94.08,63.14) ; 93.48,62.55 92.72,63.31 U10.12 ; v1(98.58,64.04) 98.58,72.1 101.31,74.83 101.61,74.83 101.79,75.01 ; v1(94.89,33.42) 95.79,32.52 v1(95.79,32.22) ; v1(100.59,33.72) 101.19,33.72 U2.12 ; 85.69,94.91 v1(85.39,94.91) ; 85.69,94.91 80,89.22 80,88.92 ; 93.69,23.03 96.99,26.33 v1(96.99,30.12) ; 93.69,23.03 93.69,23.2 92.57,24.32 U12.12 ; 91.19,118.59 90.59,117.99 v1(90.59,116.49) ; 91.19,118.59 93.59,118.59 97.99,114.2 98.58,114.2 100.08,115.7 U6.12 ; 91.19,118.59 90.89,118.89 90.89,120.69 92,121.79 U7.12 ; 80,88.92 U29.37 ; 92.59,43.82 U11.12
  Bottom Layer w0.299: v1(96.99,30.12) 95.79,31.32 v1(95.79,32.22) ; v1(90.59,116.49) 84.3,110.2 84.3,96.01 v1(85.39,94.91) ; v1(100.59,33.72) v1(97.59,33.72) 95.19,33.72 v1(94.89,33.42) ; v1(91.09,70.94) 89.89,69.74 89.89,67.34 v1(94.08,63.14) 97.68,63.14 v1(98.58,64.04)
IN165_1: length 22
  Top Layer w0.299: U14.11 12.91,15.49 6.91,9.5 5.11,9.5 4.51,8.9 4.51,4.5 5.71,3.3
IN165_2: length 15.5
  Top Layer w0.299: 17.7,14.22 15.9,14.22 v1(10.21,8.53)
  Bottom Layer w0.299: 5.71,5.84 8.4,8.53 v1(10.21,8.53)
IN165_3: length 14.6
  Top Layer w0.299: U14.13 16.8,12.95 11.41,7.56 6.54,7.56 5.71,8.38
IN165_4: length 12.3
  Top Layer w0.299: v1(15.74,10.92) 16.5,11.68 U14.14
  Bottom Layer w0.299: v1(15.74,10.92) 5.71,10.92
IN165_5: length 22.4
  Top Layer w0.299: U14.3 23.15,11.68 19.57,15.26 19.57,16.46 18.67,17.36 9.61,17.36 5.71,13.46
IN165_6: length 19
  Top Layer w0.299: U14.4 23.15,12.95 v1(20.45,15.65)
  Bottom Layer w0.299: 5.71,16 6.07,15.65 v1(20.45,15.65)
IN165_7: length 19.5
  Top Layer w0.299: v1(18.83,18.54) 23.15,14.22 23.45,14.22
  Bottom Layer w0.299: v1(18.83,18.54) 5.71,18.54
IN165_8: length 20
  Top Layer w0.299: v1(18.65,19.69) 22.85,15.49 U14.6
  Bottom Layer w0.299: v1(18.65,19.69) 7.11,19.69 5.71,21.08
IN165_9: length 26.5
  Top Layer w0.299: U15.11 9.91,35.56 6.91,32.56 5.41,32.56 4.51,31.66 4.51,31.06 3.31,29.87 2.72,29.87 1.82,28.97 1.82,28.37 2.72,27.47 3.61,27.47 4.51,26.57 4.51,25.67 5.71,24.47 5.71,23.62
IN165_10: length 15.4
  Top Layer w0.299: v1(7.81,26.5) 6.05,26.5 5.71,26.16 ; U15.12 17.1,34.29 v1(12.01,29.19)
  Bottom Layer w0.299: v1(7.81,26.5) 10.51,29.19 v1(12.01,29.19)
IN165_11: length 14
  Top Layer w0.299: 5.71,28.7 6.01,28.4 12.18,28.4 16.8,33.02 U15.13
IN165_12: length 18.6
  Top Layer w0.299: U15.14 16.2,31.75 12.01,27.55 5.21,27.55 4.61,28.15 4.61,30.13 5.71,31.24
IN165_13: length 18.6
  Top Layer w0.299: v1(19.55,33.55) 21.35,31.75 U15.3
  Bottom Layer w0.299: 5.71,33.78 5.95,33.55 v1(19.55,33.55)
IN165_14: length 20.1
  Top Layer w0.299: U15.4 23.15,33.02 18.65,37.52 6.91,37.52 5.71,36.32
IN165_15: length 19.6
  Top Layer w0.299: v1(18.65,38.79) 23.15,34.29 U15.5
  Bottom Layer w0.299: 5.71,38.86 5.79,38.79 v1(18.65,38.79)
IN165_16: length 20.2
  Top Layer w0.299: U15.6 22.85,35.56 v1(18.05,40.36)
  Bottom Layer w0.299: 5.71,41.4 17,41.4 v1(18.05,40.36)
IN165_17: length 20.3
  Top Layer w0.299: U16.11 15.3,55.63 7.51,47.83 5.41,47.83 4.51,46.93 4.51,45.14 5.71,43.94
IN165_18: length 15.2
  Top Layer w0.299: 5.71,46.48 5.8,46.56 8.11,46.56 15.9,54.36 U16.12
IN165_19: length 13.7
  Top Layer w0.299: v1(13.04,49.02) 17.1,53.09 U16.13
  Bottom Layer w0.299: v1(13.04,49.02) 5.71,49.02
IN165_20: length 12.1
  Top Layer w0.299: U16.14 16.8,51.82 v1(16.55,51.56)
  Bottom Layer w0.299: v1(16.55,51.56) 5.71,51.56
IN165_21: length 18.7
  Top Layer w0.299: v1(19.85,53.91) 21.95,51.82 U16.3
  Bottom Layer w0.299: v1(19.85,53.91) 5.9,53.91 5.71,54.1
IN165_22: length 20
  Top Layer w0.299: 5.71,56.64 6.65,57.58 18.65,57.58 23.15,53.09 U16.4
IN165_23: length 19.7
  Top Layer w0.299: v1(19.25,57.95) 22.85,54.36 U16.5
  Bottom Layer w0.299: v1(19.25,57.95) 18.22,58.98 5.91,58.98 5.71,59.18
IN165_24: length 20.3
  Top Layer w0.299: U16.6 22.85,55.63 v1(18.35,60.12)
  Bottom Layer w0.299: v1(18.35,60.12) 16.75,61.72 5.71,61.72
IN165_25: length 20.1
  Top Layer w0.299: 5.71,64.26 4.56,65.42 4.56,67.3 5.16,67.9 6.65,67.9 14.45,75.69 U17.11
IN165_26: length 15.1
  Top Layer w0.299: U17.12 15.3,74.42 7.81,66.93 5.84,66.93 5.71,66.8
IN165_27: length 13.6
  Top Layer w0.299: U17.13 16.5,73.15 v1(12.69,69.34)
  Bottom Layer w0.299: v1(12.69,69.34) 5.71,69.34
IN165_28: length 12.5
  Top Layer w0.299: v1(16.5,71.28) 17.1,71.88 U17.14
  Bottom Layer w0.299: v1(16.5,71.28) 6.31,71.28 5.71,71.88
IN165_29: length 18.8
  Top Layer w0.299: U17.3 22.85,71.88 20.45,74.28 v1(19.85,74.28)
  Bottom Layer w0.299: v1(19.85,74.28) 5.86,74.28 5.71,74.42
IN165_30: length 19.8
  Top Layer w0.299: U17.4 23.06,73.15 18.65,77.56 6.31,77.56 5.71,76.96
IN165_31: length 19.8
  Top Layer w0.299: U17.5 23.15,74.42 v1(18.35,79.22)
  Bottom Layer w0.299: 5.71,79.5 6,79.22 v1(18.35,79.22)
IN165_32: length 20.4
  Top Layer w0.299: v1(18.35,80.49) 23.15,75.69 U17.6
  Bottom Layer w0.299: 5.71,82.04 7.27,80.49 v1(18.35,80.49)
IN165_33: length 20
  Top Layer w0.299: 5.71,84.58 4.6,85.69 4.6,87.67 5.2,88.27 6.1,88.27 13.59,95.76 U18.11
IN165_34: length 15
  Top Layer w0.299: U18.12 13.08,94.49 5.71,87.12
IN165_35: length 13.6
  Top Layer w0.299: U18.13 15.9,93.22 12.91,90.22 12.91,89.92 v1(12.65,89.66)
  Bottom Layer w0.299: v1(12.65,89.66) 5.71,89.66
IN165_36: length 12.1
  Top Layer w0.299: U18.14 v1(15.6,91.95)
  Bottom Layer w0.299: v1(15.6,91.95) 5.97,91.95 5.71,92.2
IN165_37: length 18.9
  Top Layer w0.299: v1(19.85,94.65) 22.55,91.95 U18.3
  Bottom Layer w0.299: 5.71,94.74 5.81,94.65 v1(19.85,94.65)
IN165_38: length 19.8
  Top Layer w0.299: U18.4 23.15,93.22 18.65,97.71 6.15,97.71 5.71,97.28
IN165_39: length 19.9
  Top Layer w0.299: v1(18.65,98.98) 23.15,94.49 U18.5
  Bottom Layer w0.299: 5.71,99.82 6.55,98.98 v1(18.65,98.98)
IN165_40: length 20.5
  Top Layer w0.299: v1(18.35,100.55) 23.15,95.76 U18.6
  Bottom Layer w0.299: 5.71,102.36 7.52,100.55 v1(18.35,100.55)
IN165_41: length 19.9
  Top Layer w0.299: U19.11 13.34,115.82 6.15,108.63 5.25,108.63 4.65,108.03 4.65,105.97 5.71,104.9
IN165_42: length 14.9
  Top Layer w0.299: U19.12 12.83,114.55 5.71,107.44
IN165_43: length 13.3
  Top Layer w0.299: v1(12.31,109.99) 15.6,113.28 U19.13
  Bottom Layer w0.299: v1(12.31,109.99) 5.72,109.99
IN165_44: length 12.7
  Top Layer w0.299: v1(16.5,111.41) 17.1,112.01 U19.14
  Bottom Layer w0.299: 5.71,112.52 6.82,111.41 v1(16.5,111.41)
IN165_45: length 19
  Top Layer w0.299: v1(19.55,115.01) 22.55,112.01 U19.3
  Bottom Layer w0.299: v1(19.55,115.01) 5.77,115.01 5.71,115.06
IN165_46: length 19.7
  Top Layer w0.299: 5.71,117.6 5.89,117.78 18.65,117.78 23.15,113.28 U19.4
IN165_47: length 20
  Top Layer w0.299: 5.71,120.14 17.56,120.14 23.15,114.55 U19.5
IN165_48: length 20.6
  Top Layer w0.299: U19.6 22.85,115.82 v1(18.05,120.62)
  Bottom Layer w0.299: 5.71,122.68 7.78,120.62 v1(18.05,120.62)
IN165_49: length 36.8
  Top Layer w0.299: 5.71,125.22 8.11,127.62 32.04,127.62 32.94,126.72 32.94,124.02 36.44,120.52 U20.11
IN165_50: length 34.3
  Top Layer w0.299: U20.12 36.74,121.79 v1(33.74,124.79)
  Bottom Layer w0.299: 5.71,127.76 31.67,127.76 32.84,126.59 32.84,125.69 v1(33.74,124.79)
IN165_51: length 37.2
  Top Layer w0.299: v1(33.74,125.76) 36.44,123.06 U20.13
  Bottom Layer w0.299: v1(33.74,125.76) 33.74,126.36 31.14,128.96 4.37,128.96 3.17,127.76
IN165_52: length 36.7
  Top Layer w0.299: 3.17,125.22 4.37,126.42 6.17,126.42 7.97,128.22 32.25,128.22 36.14,124.33 U20.14
IN165_53: length 28.8
  Top Layer w0.299: 3.17,122.68 4.53,124.03 30.99,124.03 U20.3
IN165_54: length 29.3
  Top Layer w0.299: U20.4 7.61,123.06 5.81,121.26 4.3,121.26 3.17,120.14
IN165_55: length 30.8
  Top Layer w0.299: U20.5 23.8,121.79 v1(20.8,118.8)
  Bottom Layer w0.299: 3.17,117.6 4.37,118.8 6.11,118.8 7.31,117.6 19.6,117.6 v1(20.8,118.8)
IN165_56: length 30.4
  Top Layer w0.299: U20.6 29.49,120.52 v1(27.09,118.12)
  Bottom Layer w0.299: 3.17,115.06 4.37,116.26 25.23,116.26 v1(27.09,118.12)
IN165_57: length 39.6
  Top Layer w0.299: U21.11 36.74,101.14 v1(33.44,104.44)
  Bottom Layer w0.299: v1(33.44,104.44) 26.25,104.44 20.25,110.44 18.75,110.44 15.47,113.72 4.37,113.72 3.17,112.52
IN165_58: length 37.2
  Top Layer w0.299: U21.12 36.44,102.41 v1(34.94,103.91)
  Bottom Layer w0.299: 3.17,109.98 4.45,108.71 18.15,108.71 23.25,103.61 34.64,103.61 v1(34.94,103.91)
IN165_59: length 37.2
  Top Layer w0.299: v1(18.45,107.44) 19.35,108.34 31.94,108.34 36.6,103.68 U21.13
  Bottom Layer w0.299: 3.17,107.44 4.37,106.24 17.25,106.24 v1(18.45,107.44)
IN165_60: length 36.7
  Top Layer w0.299: U21.14 36.74,104.95 v1(36.14,105.55)
  Bottom Layer w0.299: v1(36.14,105.55) 36.14,104.05 35.24,103.16 7.66,103.16 7.11,103.7 4.37,103.7 3.17,104.9
IN165_61: length 35.9
  Top Layer w0.299: U21.3 26.79,104.95 v1(20.8,98.96)
  Bottom Layer w0.299: v1(20.8,98.96) 20.2,98.36 2.98,98.36 2.08,99.26 2.08,101.27 3.17,102.36
IN165_62: length 30.7
  Top Layer w0.299: v1(22.63,99.82) 26.49,103.68 U21.4
  Bottom Layer w0.299: 3.17,99.82 4.37,101.02 6.15,101.02 7.35,99.82 v1(22.63,99.82)
IN165_63: length 31.2
  Top Layer w0.299: U21.5 26.49,102.41 23.2,99.12 22.6,99.12 v1(21.7,98.22)
  Bottom Layer w0.299: 3.17,97.28 4.34,96.12 19.6,96.12 v1(21.7,98.22)
IN165_64: length 31.7
  Top Layer w0.299: v1(28.59,99.05) 30.69,101.14 U21.6
  Bottom Layer w0.299: v1(28.59,99.05) 23.2,93.65 4.27,93.65 3.17,94.74
IN165_65: length 42.2
  Top Layer w0.299: U22.11 36.14,81.76 v1(33.74,84.16)
  Bottom Layer w0.299: v1(33.74,84.16) 34.94,84.16 35.24,84.46 35.24,86.26 30.44,91.06 4.32,91.06 3.17,92.2
IN165_66: length 36.9
  Top Layer w0.299: v1(35.54,83.63) 36.14,83.03 U22.12
  Bottom Layer w0.299: v1(35.54,83.63) 35.24,83.33 33.44,83.33 28.34,88.43 4.41,88.43 3.17,89.66
IN165_67: length 38.1
  Top Layer w0.299: U22.13 37.33,84.3 v1(37.93,83.71)
  Bottom Layer w0.299: 3.17,87.12 4.49,85.8 30.14,85.8 33.14,82.81 37.04,82.81 v1(37.93,83.71)
IN165_68: length 38.7
  Top Layer w0.299: 3.17,84.58 4.37,83.38 7.57,83.38 v1(13.26,89.08) ; U22.14 35.24,85.57 v1(34.54,84.88)
  Bottom Layer w0.299: v1(34.54,84.88) 30.35,89.08 v1(13.26,89.08)
IN165_69: length 36
  Top Layer w0.299: U22.3 30.39,85.57 v1(25,80.18)
  Bottom Layer w0.299: v1(25,80.18) 23.2,78.38 2.64,78.38 2.04,78.98 2.04,80.91 3.17,82.04
IN165_70: length 33
  Top Layer w0.299: U22.4 30.09,84.3 v1(26.49,80.71)
  Bottom Layer w0.299: 3.17,79.5 4.32,80.64 4.32,82.21 5.21,83.11 24.1,83.11 v1(26.49,80.71)
IN165_71: length 31.6
  Top Layer w0.299: U22.5 30.69,83.03 v1(30.09,82.44)
  Bottom Layer w0.299: 3.17,76.96 4.3,75.84 23.5,75.84 v1(30.09,82.44)
IN165_72: length 32.3
  Top Layer w0.299: U22.6 30.69,81.76 v1(30.09,81.17)
  Bottom Layer w0.299: 3.17,74.42 4.52,73.07 22,73.07 v1(30.09,81.17)
IN165_73: length 37.8
  Top Layer w0.299: U23.11 36.44,62.39 v1(32.84,65.98)
  Bottom Layer w0.299: 3.17,71.88 4.28,70.78 16.05,70.78 17.85,68.98 29.84,68.98 v1(32.84,65.98)
IN165_74: length 36.5
  Top Layer w0.299: v1(34.34,65.45) 36.14,63.66 U23.12
  Bottom Layer w0.299: 3.17,69.34 4.37,68.15 29.54,68.15 32.54,65.15 34.04,65.15 v1(34.34,65.45)
IN165_75: length 36.4
  Top Layer w0.299: U23.13 36.44,64.93 v1(35.84,65.52)
  Bottom Layer w0.299: v1(35.84,65.52) 34.94,64.63 32.24,64.63 30.14,66.72 7.36,66.72 6.16,65.52 4.45,65.52 3.17,66.8
IN165_76: length 36
  Top Layer w0.299: U23.14 36.44,66.79 25.35,66.79 v1(24.15,65.6)
  Bottom Layer w0.299: 3.17,64.26 4.24,63.2 21.75,63.2 v1(24.15,65.6)
IN165_77: length 37.7
  Top Layer w0.299: v1(27.39,62.3) 27.39,62.6 30.99,66.2 U23.3
  Bottom Layer w0.299: 3.17,61.72 1.98,60.52 1.98,58.73 2.88,57.83 6.44,57.83 7.04,57.23 22.92,57.23 27.39,61.7 v1(27.39,62.3)
IN165_78: length 31.2
  Top Layer w0.299: U23.4 30.99,64.93 25.9,59.83 v1(24.4,59.83)
  Bottom Layer w0.299: v1(24.4,59.83) 24.05,59.48 7.56,59.48 6.66,60.38 4.37,60.38 3.17,59.18
IN165_79: length 31.9
  Top Layer w0.299: v1(25.3,58.26) 30.69,63.66 U23.5
  Bottom Layer w0.299: v1(25.3,58.26) 22.6,55.56 4.25,55.56 3.17,56.64
IN165_80: length 32.5
  Top Layer w0.299: U23.6 30.69,62.39 v1(25.9,57.59)
  Bottom Layer w0.299: 3.17,54.1 4.37,52.9 21.21,52.9 v1(25.9,57.59)
IN165_81: length 37.4
  Top Layer w0.299: U24.11 35.84,43.01 v1(33.44,45.4)
  Bottom Layer w0.299: 3.17,51.56 4.24,50.5 16.65,50.5 18.15,49 29.84,49 v1(33.44,45.4)
IN165_82: length 36.1
  Top Layer w0.299: v1(34.94,44.88) 35.54,44.28 U24.12
  Bottom Layer w0.299: 3.17,49.02 4.37,47.82 29.89,47.82 33.14,44.58 34.64,44.58 v1(34.94,44.88)
IN165_83: length 36.2
  Top Layer w0.299: U24.13 v1(35.54,45.55)
  Bottom Layer w0.299: v1(35.54,45.55) 35.54,44.35 35.24,44.05 7.36,44.05 6.16,45.25 4.41,45.25 3.17,46.48
IN165_84: length 43.2
  Top Layer w0.299: v1(36.14,46.22) 36.74,46.82 U24.14
  Bottom Layer w0.299: 3.17,43.94 2.1,42.87 2.1,40.82 2.7,40.22 6.76,40.22 7.36,39.62 18.45,39.62 21.45,42.62 34.64,42.62 36.14,44.12 v1(36.14,46.22)
IN165_85: length 30.4
  Top Layer w0.299: v1(27.39,43.22) 30.99,46.82 U24.3
  Bottom Layer w0.299: 3.17,41.4 4.39,42.62 7.31,42.62 7.91,43.22 v1(27.39,43.22)
IN165_86: length 31.8
  Top Layer w0.299: v1(27.39,41.95) 30.99,45.55 U24.4
  Bottom Layer w0.299: 3.17,38.86 4.28,37.75 23.2,37.75 v1(27.39,41.95)
IN165_87: length 32.4
  Top Layer w0.299: U24.5 30.99,44.28 v1(27.39,40.68)
  Bottom Layer w0.299: 3.17,36.32 4.37,35.12 21.84,35.12 v1(27.39,40.68)
IN165_88: length 32.9
  Top Layer w0.299: v1(27.69,39.71) 30.99,43.01 U24.6
  Bottom Layer w0.299: 3.17,33.78 4.37,32.58 20.57,32.58 v1(27.69,39.71)
IN165_89: length 37
  Top Layer w0.299: U25.11 36.74,23.63 v1(33.74,26.62)
  Bottom Layer w0.299: 3.17,31.24 4.5,29.92 13.06,29.92 16.35,26.62 v1(33.74,26.62)
IN165_90: length 35.8
  Top Layer w0.299: v1(35.24,26.09) 36.44,24.9 U25.12
  Bottom Layer w0.299: 3.17,28.7 4.37,27.5 5.96,27.5 7.75,25.71 34.85,25.71 v1(35.24,26.09)
IN165_91: length 38.9
  Top Layer w0.299: v1(7.06,23.47) 6,22.41 5.43,22.41 4.37,23.47 4.37,24.97 3.17,26.16 ; v1(36.14,26.77) 36.74,26.17 U25.13
  Bottom Layer w0.299: v1(7.06,23.47) 33.74,23.47 36.14,25.87 v1(36.14,26.77)
IN165_92: length 38.3
  Top Layer w0.299: v1(37.93,26.84) 37.33,27.44 U25.14
  Bottom Layer w0.299: v1(37.93,26.84) 33.44,22.34 4.46,22.34 3.17,23.62
IN165_93: length 34.4
  Top Layer w0.299: U25.3 27.69,27.44 v1(24.7,24.44)
  Bottom Layer w0.299: v1(24.7,24.44) 24.4,24.74 2.64,24.74 2.04,24.14 2.04,22.22 3.17,21.08
IN165_94: length 32.3
  Top Layer w0.299: U25.4 30.69,26.17 v1(24.7,20.17)
  Bottom Layer w0.299: 3.17,18.54 4.37,17.34 21.87,17.34 v1(24.7,20.17)
IN165_95: length 32.9
  Top Layer w0.299: U25.5 30.69,24.9 v1(25,19.2)
  Bottom Layer w0.299: v1(25,19.2) 20.5,14.71 4.47,14.71 3.17,16
IN165_96: length 33.3
  Top Layer w0.299: v1(25.3,17.93) 30.99,23.63 U25.6
  Bottom Layer w0.299: v1(25.3,17.93) 19.63,12.26 4.37,12.26 3.17,13.46
IN165_97: length 36.6
  Top Layer w0.299: v1(34.64,4.85) 35.24,4.25 U26.11
  Bottom Layer w0.299: 3.17,10.92 4.45,9.64 29.84,9.64 v1(34.64,4.85)
IN165_98: length 43.3
  Top Layer w0.299: U26.12 37.33,5.52 v1(37.93,4.92)
  Bottom Layer w0.299: 3.17,8.38 1.97,7.18 1.97,5.52 2.87,4.62 3.47,4.62 4.37,3.72 4.37,3.12 5.27,2.22 35.24,2.22 v1(37.93,4.92)
IN165_99: length 36.2
  Top Layer w0.299: v1(35.54,5.59) 36.74,6.79 U26.13
  Bottom Layer w0.299: v1(35.54,5.59) 35.54,4.69 34.94,4.09 7.36,4.09 6.81,4.64 4.37,4.64 3.17,5.84
IN165_100: length 39.2
  Top Layer w0.299: U26.14 36.74,8.06 32.58,3.9 32.58,1.5 31.98,0.9 5.57,0.9 3.17,3.3
OUT595_1: length 23.5
  Top Layer w0.299: U1.15 v1(103.28,10.16)
  Bottom Layer w0.299: v1(103.28,10.16) 118.24,10.16 119.14,9.26 119.14,5.06 120.27,3.94
OUT595_2: length 14
  Top Layer w0.299: U1.1 108.46,7.69 119.05,7.69 120.27,6.48
OUT595_3: length 13.5
  Top Layer w0.299: 120.27,9.02 119.13,10.16 U1.2
OUT595_4: length 14
  Top Layer w0.299: 120.27,11.56 119.2,12.63 117.15,12.63 115.95,11.43 U1.3
OUT595_5: length 14.6
  Top Layer w0.299: U1.4 114.75,12.7 117.35,15.3 119.07,15.3 120.27,14.1
OUT595_6: length 15.1
  Top Layer w0.299: 120.27,16.64 119.04,17.87 117.45,17.87 113.55,13.97 U1.5
OUT595_7: length 15.6
  Top Layer w0.299: U1.6 112.05,15.24 117.15,20.34 119.11,20.34 120.27,19.18
OUT595_8: length 16.1
  Top Layer w0.299: U1.7 110.85,16.51 117.15,22.8 119.18,22.8 120.27,21.72
OUT595_9: length 23.5
  Top Layer w0.299: U2.15 v1(103.28,30.51)
  Bottom Layer w0.299: 120.27,24.26 119.12,25.41 119.12,29.61 118.22,30.51 v1(103.28,30.51)
OUT595_10: length 14
  Top Layer w0.299: 120.27,26.8 119.03,28.04 108.46,28.04 U2.1
OUT595_11: length 13.5
  Top Layer w0.299: U2.2 119.1,30.51 120.27,29.34
OUT595_12: length 14
  Top Layer w0.299: 120.27,31.88 119.17,32.97 117.15,32.97 115.95,31.78 U2.3
OUT595_13: length 14.6
  Top Layer w0.299: U2.4 114.75,33.05 117.32,35.62 119.07,35.62 120.27,34.42
OUT595_14: length 15.1
  Top Layer w0.299: 120.27,36.96 119.07,38.16 117.39,38.16 113.55,34.32 U2.5
OUT595_15: length 15.6
  Top Layer w0.299: 120.27,39.5 119.09,40.68 117.15,40.68 112.05,35.59 U2.6
OUT595_16: length 16.1
  Top Layer w0.299: U2.7 110.85,36.86 117.15,43.15 119.16,43.15 120.27,42.04
OUT595_17: length 22.5
  Top Layer w0.299: U3.15 102.08,50.85 103.28,49.65 v1(103.28,48.75)
  Bottom Layer w0.299: v1(103.28,48.75) 103.58,48.45 117.97,48.45 119.17,47.25 119.17,45.68 120.27,44.58
OUT595_18: length 15
  Top Layer w0.299: U3.1 110.85,45.98 119.14,45.98 120.27,47.12
OUT595_19: length 13.5
  Top Layer w0.299: U3.2 119.08,50.85 120.27,49.66
OUT595_20: length 14
  Top Layer w0.299: U3.3 115.95,52.12 117.15,53.32 119.15,53.32 120.27,52.2
OUT595_21: length 14.6
  Top Layer w0.299: U3.4 114.75,53.39 117.29,55.94 119.07,55.94 120.27,54.74
OUT595_22: length 15.1
  Top Layer w0.299: U3.5 113.55,54.66 117.37,58.48 119.07,58.48 120.27,57.28
OUT595_23: length 15.6
  Top Layer w0.299: U3.6 112.05,55.93 117.15,61.03 119.06,61.03 120.27,59.82
OUT595_24: length 16.1
  Top Layer w0.299: 120.27,62.36 119.13,63.5 117.15,63.5 110.85,57.2 U3.7
OUT595_25: length 24
  Top Layer w0.299: v1(103.58,70.6) 102.98,71.2 U4.15
  Bottom Layer w0.299: 120.27,64.9 119.06,66.1 119.06,70.3 118.17,71.2 104.18,71.2 v1(103.58,70.6)
OUT595_26: length 15
  Top Layer w0.299: 107.26,69.93 110.85,66.33 119.16,66.33 120.27,67.44
OUT595_27: length 13.5
  Top Layer w0.299: 120.27,69.98 119.05,71.2 U4.2
OUT595_28: length 14
  Top Layer w0.299: 120.27,72.52 119.12,73.67 117.15,73.67 115.95,72.47 U4.3
OUT595_29: length 14.5
  Top Layer w0.299: 120.27,75.06 119.19,76.13 117.15,76.13 114.75,73.74 U4.4
OUT595_30: length 15.1
  Top Layer w0.299: 107.26,75.01 113.55,75.01 117.34,78.8 119.07,78.8 120.27,77.6
OUT595_31: length 15.6
  Top Layer w0.299: U4.6 112.35,76.28 117.41,81.34 119.07,81.34 120.27,80.14
OUT595_32: length 16.1
  Top Layer w0.299: 120.27,82.68 119.11,83.84 117.15,83.84 110.85,77.55 U4.7
OUT595_33: length 23.9
  Top Layer w0.299: U5.15 102.98,91.54 v1(103.28,91.24)
  Bottom Layer w0.299: v1(103.28,91.24) 103.58,91.54 118.27,91.54 119.17,90.64 119.17,86.32 120.27,85.22
OUT595_34: length 15
  Top Layer w0.299: U5.1 110.85,86.68 119.19,86.68 120.27,87.76
OUT595_35: length 14.5
  Top Layer w0.299: 120.27,90.3 119.12,89.14 117.15,89.14 114.75,91.54 U5.2
OUT595_36: length 14
  Top Layer w0.299: U5.3 116.25,92.81 117.45,91.61 119.04,91.61 120.27,92.84
OUT595_37: length 13.5
  Top Layer w0.299: 120.27,95.38 118.97,94.08 U5.4
OUT595_38: length 15.1
  Top Layer w0.299: U5.5 113.55,95.35 117.31,99.12 119.07,99.12 120.27,97.92
OUT595_39: length 15.6
  Top Layer w0.299: U5.6 112.35,96.62 117.39,101.66 119.07,101.66 120.27,100.46
OUT595_40: length 16.1
  Top Layer w0.299: 120.27,103 119.08,104.19 117.15,104.19 110.85,97.89 U5.7
OUT595_41: length 24
  Top Layer w0.299: v1(102.98,111.29) 102.39,111.89 U6.15
  Bottom Layer w0.299: 120.27,105.54 119.17,106.64 119.17,110.69 117.97,111.89 103.58,111.89 v1(102.98,111.29)
OUT595_42: length 14.1
  Top Layer w0.299: U6.1 108.46,109.42 118.93,109.42 120.27,108.08
OUT595_43: length 13.5
  Top Layer w0.299: U6.2 119,111.89 120.27,110.62
OUT595_44: length 14
  Top Layer w0.299: 120.27,113.16 119.07,114.36 117.15,114.36 115.95,113.16 U6.3
OUT595_45: length 14.5
  Top Layer w0.299: 120.27,115.7 119.14,116.83 117.15,116.83 114.75,114.43 U6.4
OUT595_46: length 15.1
  Top Layer w0.299: U6.5 113.55,115.7 117.29,119.44 119.07,119.44 120.27,118.24
OUT595_47: length 15.6
  Top Layer w0.299: 120.27,120.78 119.07,121.98 117.36,121.98 112.35,116.97 U6.6
OUT595_48: length 16.1
  Top Layer w0.299: U6.7 110.85,118.24 117.15,124.53 119.05,124.53 120.27,123.32
OUT595_49: length 29.1
  Top Layer w0.299: U7.15 95.87,125.6 v1(96.12,125.86)
  Bottom Layer w0.299: v1(96.12,125.86) 97.32,127.06 119.07,127.06 120.27,125.86
OUT595_50: length 35.1
  Top Layer w0.299: U7.1 89.5,129.57 119.1,129.57 120.27,128.4
OUT595_51: length 32.1
  Top Layer w0.299: 117.73,128.4 117.63,128.3 91.3,128.3 88.6,125.6 U7.2
OUT595_52: length 33
  Top Layer w0.299: 117.73,125.86 115.96,127.63 91.3,127.63 88,124.33 U7.3
OUT595_53: length 31
  Top Layer w0.299: U7.4 90.4,123.06 v1(90.65,123.32)
  Bottom Layer w0.299: v1(90.65,123.32) 117.73,123.32
OUT595_54: length 31.4
  Top Layer w0.299: v1(89.2,121.19) 88.6,121.79 U7.5
  Bottom Layer w0.299: 117.73,120.78 89.61,120.78 v1(89.2,121.19)
OUT595_55: length 31.9
  Top Layer w0.299: U7.6 v1(88.3,120.52)
  Bottom Layer w0.299: 117.73,118.24 90.58,118.24 v1(88.3,120.52)
OUT595_56: length 35.6
  Top Layer w0.299: U7.7 86.5,119.25 85.3,118.05 85.3,117.75 87.36,115.7 v1(94.25,115.7)
  Bottom Layer w0.299: v1(94.25,115.7) 117.73,115.7
OUT595_57: length 29.3
  Top Layer w0.299: v1(96.17,110) 95.57,109.41 95.57,108.81 92.87,106.11 U8.15
  Bottom Layer w0.299: 117.73,113.16 98.42,113.16 96.17,110.9 v1(96.17,110)
OUT595_58: length 32.3
  Top Layer w0.299: v1(96.93,110.62) 90.04,110.62 U8.1
  Bottom Layer w0.299: v1(96.93,110.62) 117.73,110.62
OUT595_59: length 31.7
  Top Layer w0.299: U8.2 88.6,106.11 90.57,108.08 v1(93.86,108.08)
  Bottom Layer w0.299: v1(93.86,108.08) 117.73,108.08
OUT595_60: length 31.2
  Top Layer w0.299: U8.3 89.5,104.84 v1(90.1,105.44)
  Bottom Layer w0.299: 117.73,105.54 117.63,105.44 v1(90.1,105.44)
OUT595_61: length 31.2
  Top Layer w0.299: U8.4 88.9,103.57 v1(89.47,103)
  Bottom Layer w0.299: v1(89.47,103) 117.73,103
OUT595_62: length 31.7
  Top Layer w0.299: U8.5 88.6,102.3 v1(89.5,101.4)
  Bottom Layer w0.299: 117.73,100.46 116.79,101.4 v1(89.5,101.4)
OUT595_63: length 32.2
  Top Layer w0.299: v1(88.9,100.13) 88,101.03 U8.6
  Bottom Layer w0.299: v1(88.9,100.13) 115.52,100.13 117.73,97.92
OUT595_64: length 35.6
  Top Layer w0.299: v1(85.6,100.36) 86.2,99.76 U8.7
  Bottom Layer w0.299: 117.73,95.38 90.58,95.38 v1(85.6,100.36)
OUT595_65: length 44.6
  Top Layer w0.299: v1(91.07,86.01) 91.67,86.61 U9.15
  Bottom Layer w0.299: v1(91.07,86.01) 91.67,86.61 118.05,86.61 118.95,85.72 118.95,84.82 119.84,83.92 120.74,83.92 121.34,84.52 121.34,90.81 120.44,91.71 118.86,91.71 117.73,92.84
OUT595_66: length 31.9
  Top Layer w0.299: U9.1 89.2,90.28 v1(95.19,90.28)
  Bottom Layer w0.299: 117.73,90.3 117.71,90.28 v1(95.19,90.28)
OUT595_67: length 31.4
  Top Layer w0.299: v1(90.64,87.76) 89.5,86.61 U9.2
  Bottom Layer w0.299: v1(90.64,87.76) 117.73,87.76
OUT595_68: length 31
  Top Layer w0.299: v1(90.82,85.22) 90.7,85.34 U9.3
  Bottom Layer w0.299: v1(90.82,85.22) 117.73,85.22
OUT595_69: length 31.5
  Top Layer w0.299: v1(90.59,82.68) 89.99,82.68 88.6,84.07 U9.4
  Bottom Layer w0.299: v1(90.59,82.68) 117.73,82.68
OUT595_70: length 32
  Top Layer w0.299: v1(90.1,80.41) 87.7,82.8 U9.5
  Bottom Layer w0.299: v1(90.1,80.41) 117.46,80.41 117.73,80.14
OUT595_71: length 32.6
  Top Layer w0.299: U9.6 87.4,81.53 v1(90.1,78.84)
  Bottom Layer w0.299: v1(90.1,78.84) 116.49,78.84 117.73,77.6
OUT595_72: length 35.5
  Top Layer w0.299: U9.7 86.2,80.26 v1(85.6,79.66)
  Bottom Layer w0.299: v1(85.6,79.66) 90.1,75.17 117.62,75.17 117.73,75.06
OUT595_73: length 30.9
  Top Layer w0.299: v1(94.37,72.21) 90.77,68.62 90.77,68.32 91.97,67.12 U10.15
  Bottom Layer w0.299: 117.73,72.52 117.43,72.21 v1(94.37,72.21)
OUT595_74: length 31.6
  Top Layer w0.299: U10.1 89.5,68.39 v1(91.08,69.98)
  Bottom Layer w0.299: v1(91.08,69.98) 117.73,69.98
OUT595_75: length 31.1
  Top Layer w0.299: U10.2 87.1,67.42 v1(90.7,67.42)
  Bottom Layer w0.299: 117.73,67.44 117.71,67.42 v1(90.7,67.42)
OUT595_76: length 31.3
  Top Layer w0.299: U10.3 87.45,65.2 v1(93.45,65.2)
  Bottom Layer w0.299: 117.73,64.9 117.43,65.2 v1(93.45,65.2)
OUT595_77: length 31.9
  Top Layer w0.299: v1(90.1,63.08) 88.6,64.58 U10.4
  Bottom Layer w0.299: 117.73,62.36 90.82,62.36 v1(90.1,63.08)
OUT595_78: length 32.4
  Top Layer w0.299: v1(89.2,62.41) 88.3,63.31 U10.5
  Bottom Layer w0.299: v1(89.2,62.41) 91.79,59.82 117.73,59.82
OUT595_79: length 32.9
  Top Layer w0.299: v1(88.6,61.74) 88.3,62.04 U10.6
  Bottom Layer w0.299: 117.73,57.28 93.06,57.28 v1(88.6,61.74)
OUT595_80: length 35.8
  Top Layer w0.299: v1(85.6,60.17) 86.2,60.77 U10.7
  Bottom Layer w0.299: 117.73,54.74 91.03,54.74 v1(85.6,60.17)
OUT595_81: length 27.4
  Top Layer w0.299: U11.15 92.57,47.62 v1(93.77,48.82)
  Bottom Layer w0.299: v1(93.77,48.82) 97.14,52.2 117.73,52.2
OUT595_82: length 32
  Top Layer w0.299: v1(90.7,48.6) 90.4,48.9 U11.1
  Bottom Layer w0.299: v1(90.7,48.6) 91.3,48 93.99,48 95.49,49.49 117.57,49.49 117.73,49.66
OUT595_83: length 31.1
  Top Layer w0.299: v1(90.1,47.33) 89.8,47.62 U11.2
  Bottom Layer w0.299: v1(90.1,47.33) 117.52,47.33 117.73,47.12
OUT595_84: length 31.7
  Top Layer w0.299: U11.3 88.3,46.36 v1(88.9,45.76)
  Bottom Layer w0.299: 117.73,44.58 116.55,45.76 v1(88.9,45.76)
OUT595_85: length 32.2
  Top Layer w0.299: U11.4 87.1,45.09 v1(90.15,42.04)
  Bottom Layer w0.299: v1(90.15,42.04) 117.73,42.04
OUT595_86: length 32.7
  Top Layer w0.299: v1(91,40.52) 90.4,40.52 87.1,43.82 U11.5
  Bottom Layer w0.299: v1(91,40.52) 116.71,40.52 117.73,39.5
OUT595_87: length 33.2
  Top Layer w0.299: U11.6 87.1,42.55 v1(91.59,38.05)
  Bottom Layer w0.299: v1(91.59,38.05) 116.64,38.05 117.73,36.96
OUT595_88: length 33.8
  Top Layer w0.299: U11.7 87.4,41.28 v1(94.29,34.38)
  Bottom Layer w0.299: v1(94.29,34.38) 117.69,34.38 117.73,34.42
OUT595_89: length 27
  Top Layer w0.299: U12.15 93.17,28.13 v1(96.77,31.73)
  Bottom Layer w0.299: 117.73,31.88 117.58,31.73 v1(96.77,31.73)
OUT595_90: length 31.7
  Top Layer w0.299: U12.1 87.7,30.3 v1(93.69,30.3)
  Bottom Layer w0.299: 117.73,29.34 94.66,29.34 v1(93.69,30.3)
OUT595_91: length 32
  Top Layer w0.299: v1(94.13,26.8) 93.53,26.2 91.13,26.2 89.2,28.13 U12.2
  Bottom Layer w0.299: v1(94.13,26.8) 117.73,26.8
OUT595_92: length 32
  Top Layer w0.299: U12.3 88.6,26.86 v1(90.4,25.06)
  Bottom Layer w0.299: v1(90.4,25.06) 116.92,25.06 117.73,24.26
OUT595_93: length 32.5
  Top Layer w0.299: v1(89.8,24.09) 88.3,25.59 U12.4
  Bottom Layer w0.299: v1(89.8,24.09) 115.35,24.09 117.73,21.72
OUT595_94: length 33.1
  Top Layer w0.299: v1(88.9,23.42) 88,24.32 U12.5
  Bottom Layer w0.299: v1(88.9,23.42) 113.48,23.42 117.73,19.18
OUT595_95: length 33.6
  Top Layer w0.299: v1(88.3,22.75) 88,23.05 U12.6
  Bottom Layer w0.299: 117.73,16.64 111.61,22.75 v1(88.3,22.75)
OUT595_96: length 37.3
  Top Layer w0.299: U12.7 86.5,21.78 85.3,20.58 85.3,20.28 91.3,14.29 v1(92.49,14.29)
  Bottom Layer w0.299: v1(92.49,14.29) 117.54,14.29 117.73,14.1
OUT595_97: length 30.3
  Top Layer w0.299: U13.15 91.97,8.64 90.77,9.84 90.77,10.13 v1(91.67,11.03)
  Bottom Layer w0.299: 117.73,11.56 101.49,11.56 100.36,10.43 92.27,10.43 v1(91.67,11.03)
